# EAGLE schematic schematic 1 nanang (EAGLE 7.5.0)
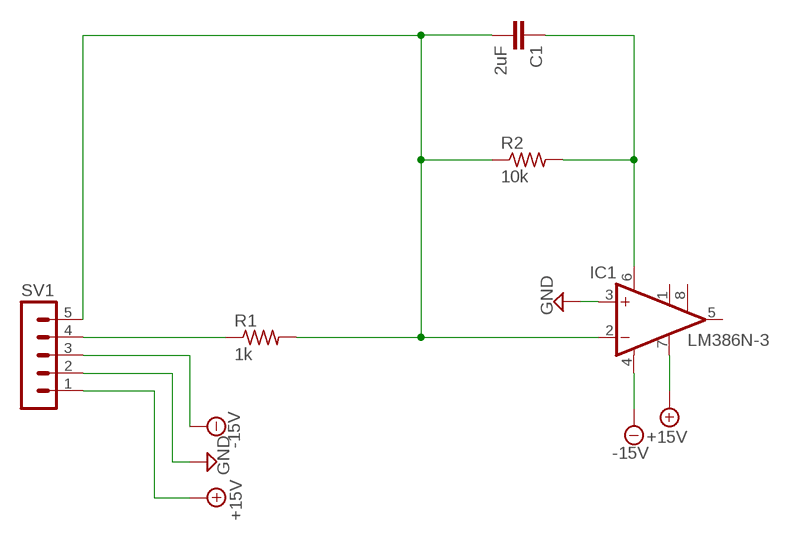
[diagram p0: schematic, sheet 1]

## Parts
C1  2uF  C2,5-3  [C2.5-3]
IC1  LM386N-3  [DIL08]
R1  1k  R-US_0204/7  [0204/7]
R2  10k  R-US_0204/7  [0204/7]
SV1  MA05-1  [MA05-1]

## Nets
+15V: IC1.7(BYPASS) SV1.1
-15V: IC1.4(GND) SV1.3
GND: IC1.3(+IN) SV1.2
N$1: C1.2 IC1.2(-IN) R1.2 R2.1 SV1.5
N$2: C1.1 IC1.6(VS) R2.2
N$5: R1.1 SV1.4
Unconnected: IC1.1(GAIN) IC1.5(OUT) IC1.8(GAIN)

## Library data of the parts
C1 = capacitor-wima:C: CAPACITOR naming: grid - package width
IC1 = linear:LM386?-*: Low Voltage Audio Power Amplifier Source: http://cache.national.com/ds/LM/LM386.pdf
R1 R2 = resistor:R-US_: RESISTOR, American symbol
SV1 = con-lstb:MA05-1: PIN HEADER; OC_FARNELL: unknown; OC_NEWARK: unknown